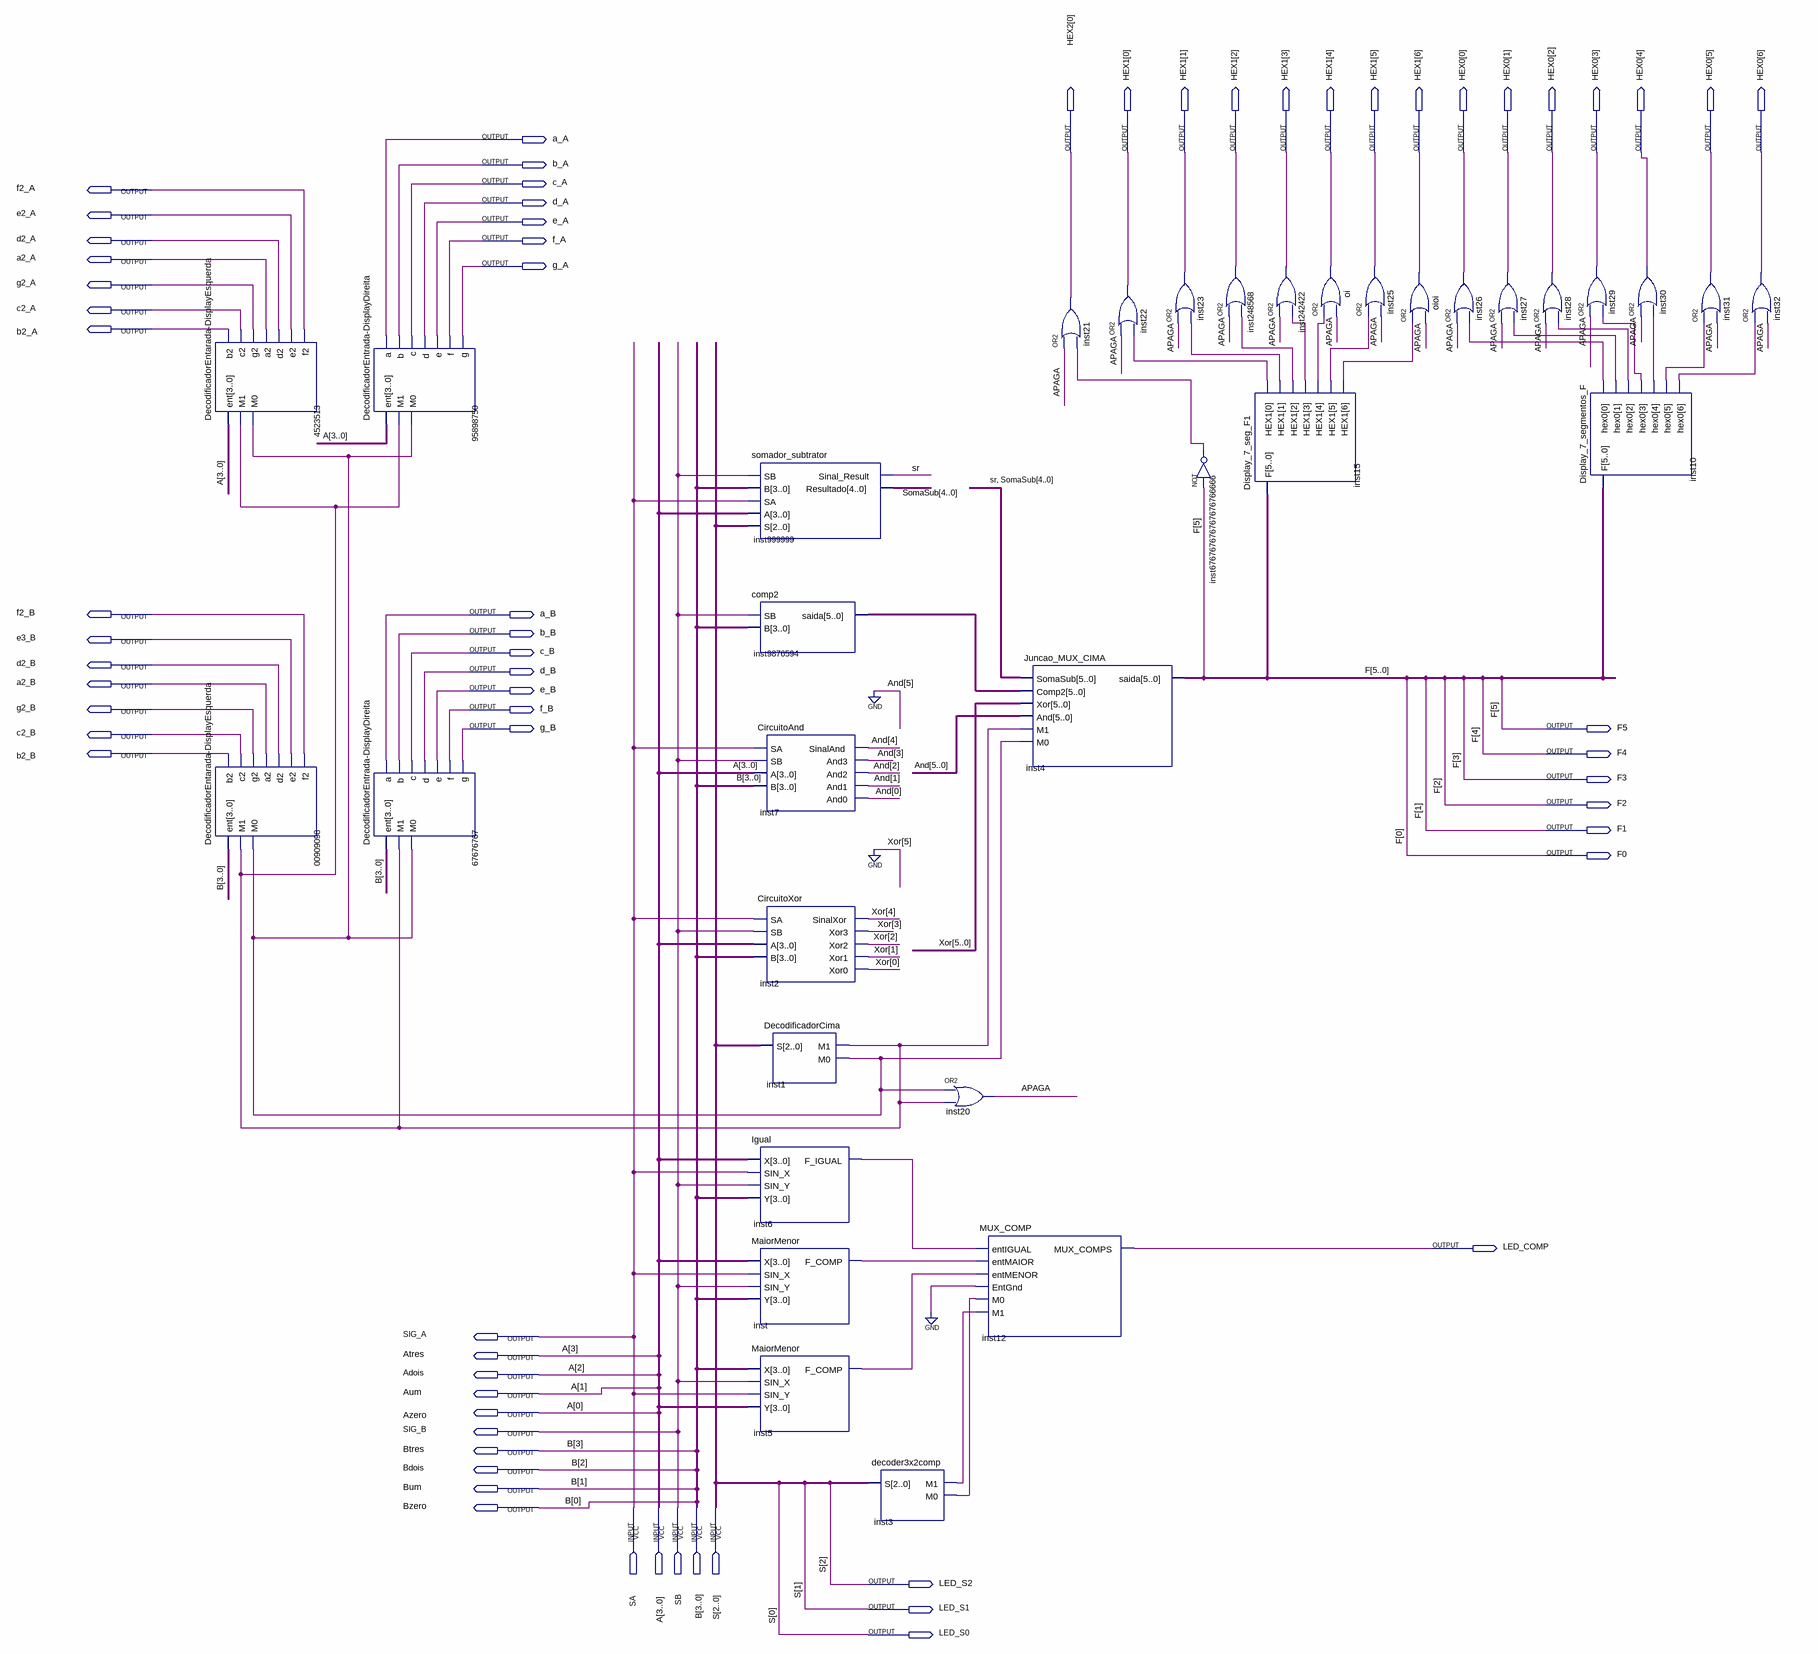
[diagram p0: schematic sheet]
// Quartus schematic trabalhoSD.bdf as structural Verilog: 34 symbols, 68 pins
module trabalhoSD (
  input  SA,
  input  [3:0] A,
  input  SB,
  input  [3:0] B,
  input  [2:0] S,
  output a_A,
  output [0:0] HEX2,
  output [6:0] HEX1,
  output [6:0] HEX0,
  output b_A,
  output c_A,
  output f2_A,
  output d_A,
  output e2_A,
  output e_A,
  output d2_A,
  output f_A,
  output a2_A,
  output g_A,
  output g2_A,
  output c2_A,
  output b2_A,
  output f2_B,
  output a_B,
  output b_B,
  output e3_B,
  output c_B,
  output d2_B,
  output d_B,
  output a2_B,
  output e_B,
  output g2_B,
  output f_B,
  output g_B,
  output F5,
  output c2_B,
  output b2_B,
  output F4,
  output F3,
  output F2,
  output F1,
  output F0,
  output LED_COMP,
  output SIG_A,
  output Atres,
  output Adois,
  output Aum,
  output Azero,
  output SIG_B,
  output Btres,
  output Bdois,
  output Bum,
  output Bzero,
  output LED_S2,
  output LED_S1,
  output LED_S0
);

  wire APAGA, inst1_m0, inst1_m1, inst3_m0, inst3_m1, inst5_f_comp, inst6_f_igual, inst10_hex0,
       inst10_hex0_2, inst10_hex0_3, inst10_hex0_4, inst10_hex0_5, inst10_hex0_6, inst10_hex0_7, inst15_hex1,
       inst15_hex1_2, inst15_hex1_3, inst15_hex1_4, inst15_hex1_5, inst15_hex1_6, inst15_hex1_7,
       inst676767676767676766666_out, inst_f_comp, sr;
  wire [4:0] And, SomaSub, Xor;
  wire [5:0] inst9876594_saida;

  \DecodificadorEntarada-DisplayEsquerda  u_4523513 (
    .ent(A), .M1(inst1_m1), .M0(inst1_m0), .b2(b2_A), .c2(c2_A), .g2(g2_A), .a2(a2_A), .d2(d2_A), .e2(e2_A),
    .f2(f2_A));
  \DecodificadorEntarada-DisplayEsquerda  u_00909098 (
    .ent(B), .M1(inst1_m1), .M0(inst1_m0), .b2(b2_B), .c2(c2_B), .g2(g2_B), .a2(a2_B), .d2(d2_B), .e2(e3_B),
    .f2(f2_B));
  \DecodificadorEntrada-DisplayDireita  u_95898750 (
    .ent(A), .M1(inst1_m1), .M0(inst1_m0), .a(a_A), .b(b_A), .c(c_A), .d(d_A), .e(e_A), .f(f_A), .g(g_A));
  \DecodificadorEntrada-DisplayDireita  u_67676767 (
    .ent(B), .M1(inst1_m1), .M0(inst1_m0), .a(a_B), .b(b_B), .c(c_B), .d(d_B), .e(e_B), .f(f_B), .g(g_B));
  somador_subtrator inst999999 (.SB(SB), .B(B), .SA(SA), .A(A), .S(S), .Sinal_Result(sr), .Resultado(SomaSub));
  comp2 inst9876594 (.SB(SB), .B(B), .saida(inst9876594_saida));
  CircuitoAnd inst7 (
    .SA(SA), .SB(SB), .A(A), .B(B), .SinalAnd(And[4]), .And3(And[3]), .And2(And[2]), .And1(And[1]),
    .And0(And[0]));
  CircuitoXor inst2 (
    .SA(SA), .SB(SB), .A(A), .B(B), .SinalXor(Xor[4]), .Xor3(Xor[3]), .Xor2(Xor[2]), .Xor1(Xor[1]),
    .Xor0(Xor[0]));
  Igual inst6 (.X(A), .SIN_X(SA), .SIN_Y(SB), .Y(B), .F_IGUAL(inst6_f_igual));
  MaiorMenor inst (.X(A), .SIN_X(SA), .SIN_Y(SB), .Y(B), .F_COMP(inst_f_comp));
  MaiorMenor inst5 (.X(B), .SIN_X(SB), .SIN_Y(SA), .Y(A), .F_COMP(inst5_f_comp));
  DecodificadorCima inst1 (.S(S), .M1(inst1_m1), .M0(inst1_m0));
  decoder3x2comp inst3 (.S(S), .M1(inst3_m1), .M0(inst3_m0));
  or inst20 (APAGA, inst1_m0, inst1_m1);
  MUX_COMP inst12 (
    .entIGUAL(inst6_f_igual), .entMAIOR(inst_f_comp), .entMENOR(inst5_f_comp), .EntGnd(1'b0), .M0(inst3_m0),
    .M1(inst3_m1), .MUX_COMPS(LED_COMP));
  or inst21 (HEX2[0], APAGA, inst676767676767676766666_out);
  Juncao_MUX_CIMA inst4 (
    .SomaSub({sr, SomaSub}), .Comp2(inst9876594_saida), .Xor({1'b0, Xor}), .And({1'b0, And}), .M1(inst1_m1),
    .M0(inst1_m0), .saida({F5, F4, F3, F2, F1, F0}));
  or inst22 (HEX1[0], APAGA, inst15_hex1);
  or inst23 (HEX1[1], APAGA, inst15_hex1_3);
  not inst676767676767676766666 (inst676767676767676766666_out, F5);
  or inst248568 (HEX1[2], APAGA, inst15_hex1_4);
  Display_7_seg_F1 inst15 (
    .F({F5, F4, F3, F2, F1, F0}),
    .HEX1({inst15_hex1_7, inst15_hex1_6, inst15_hex1_5, inst15_hex1_2, inst15_hex1_4, inst15_hex1_3, inst15_hex1}));
  or inst242422 (HEX1[3], APAGA, inst15_hex1_2);
  or oi (HEX1[4], inst15_hex1_5, APAGA);
  or inst25 (HEX1[5], inst15_hex1_6, APAGA);
  or oioi (HEX1[6], inst15_hex1_7, APAGA);
  or inst26 (HEX0[0], APAGA, inst10_hex0);
  or inst27 (HEX0[1], APAGA, inst10_hex0_2);
  or inst28 (HEX0[2], APAGA, inst10_hex0_3);
  or inst29 (HEX0[3], APAGA, inst10_hex0_4);
  Display_7_segmentos_F inst10 (
    .F({F5, F4, F3, F2, F1, F0}),
    .hex0({inst10_hex0_6, inst10_hex0_5, inst10_hex0_7, inst10_hex0_4, inst10_hex0_3, inst10_hex0_2, inst10_hex0}));
  or inst30 (HEX0[4], APAGA, inst10_hex0_7);
  or inst31 (HEX0[5], inst10_hex0_5, APAGA);
  or inst32 (HEX0[6], inst10_hex0_6, APAGA);

  assign Adois = A[2];
  assign Atres = A[3];
  assign Aum = A[1];
  assign Azero = A[0];
  assign Bdois = B[2];
  assign Btres = B[3];
  assign Bum = B[1];
  assign Bzero = B[0];
  assign LED_S0 = S[0];
  assign LED_S1 = S[1];
  assign LED_S2 = S[2];
  assign SIG_A = SA;
  assign SIG_B = SB;
endmodule
